# Altium schematic sheet soc.SchDoc: SoC
size A4; CheckedBy: None; DrawnBy: David, Andrea; Organization: ETSIT; DocumentNumber: 2; Revision: V1.0; SheetNumber: 2; SheetTotal: 7; SPICEModelCacheJYSJDKYB: <root> / <DocumentId>JYSJDKYB</DocumentId> / <CacheFrame Number="0"> / <Model Name="cap" Kind="MDL"> / <Text>*Default semiconductor capacitor / .MODEL CAP C()</Text> / </Model> / </CacheFrame> / </root>; TotalSheet: 7; VersionRevision: v1.0; Project: Hefesto; Company: ETSIT
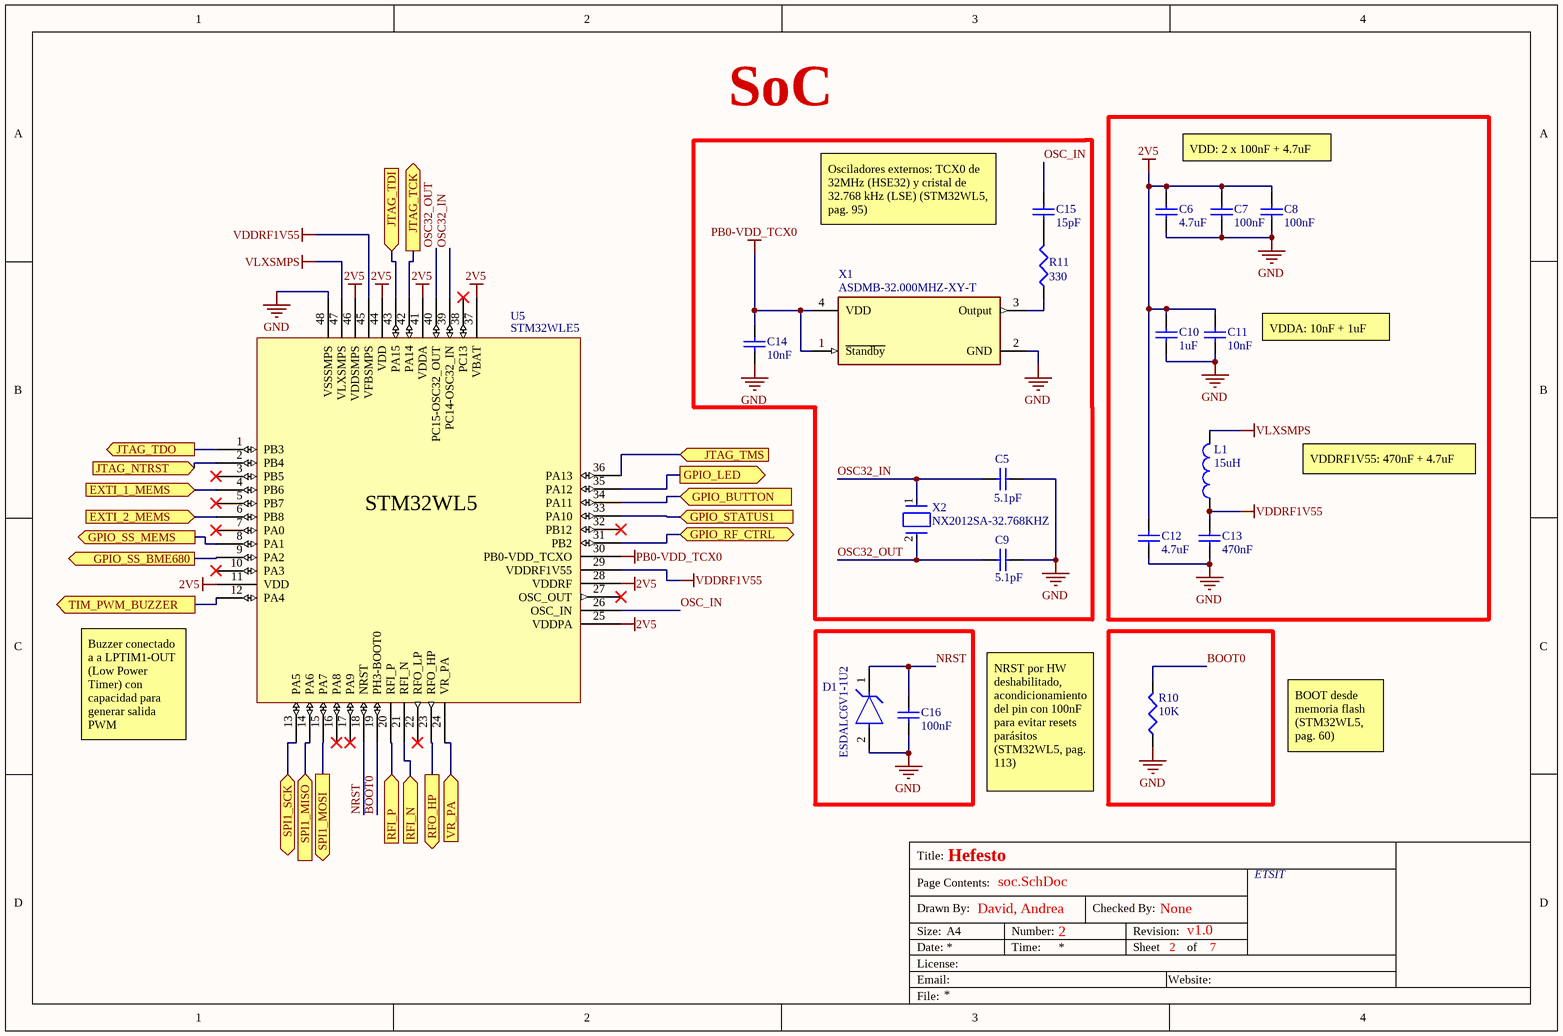
[diagram p0: soc.SchDoc]

## Parts
C5  value 5.1pF  [1608[0603]]  (hidden comment: Cap Semi)
C6  value 4.7uF  [1608[0603]]  (hidden comment: Cap Semi)
C7  value 100nF  [1608[0603]]  (hidden comment: Cap Semi)
C8  value 100nF  [1608[0603]]  (hidden comment: Cap Semi)
C9  value 5.1pF  [1608[0603]]  (hidden comment: Cap Semi)
C10  value 1uF  [1608[0603]]  (hidden comment: Cap Semi)
C11  value 10nF  [1608[0603]]  (hidden comment: Cap Semi)
C12  value 4.7uF  [1608[0603]]  (hidden comment: Cap Semi)
C13  value 470nF  [1608[0603]]  (hidden comment: Cap Semi)
C14  value 10nF  [1608[0603]]  (hidden comment: Cap Semi)
C15  value 15pF  [1608[0603]]  (hidden comment: Cap Semi)
C16  value 100nF  [1608[0603]]  (hidden comment: Cap Semi)
D1  ESDALC6V1-1U2  [FP-ST0201-MFG]
L1  value 15uH  [0603]  (hidden comment: Inductor)
R10  value 10K  [J1-0603]  (hidden comment: Res3)
R11  value 330  [J1-0603]  (hidden comment: Res3)
U5  STM32WLE5  [UFQFPN48]
X1  ASDMB-32.000MHZ-XY-T  [FP-ASDM-ASDMB-MFG]
X2  NX2012SA-32.768KHZ  [FP-NX2012SA-MFG]

## Ports
EXTI_1_MEMS (in, see main[2C]), EXTI_2_MEMS (in, see main[2C]), GPIO_BUTTON (in, see main[3B]), GPIO_LED (out, see main[3B]), GPIO_RF_CTRL (bidir, see main[3C]), GPIO_SS_BME680 (out, see main[2B]), GPIO_SS_MEMS (out, see main[2C]), GPIO_STATUS1 (in, see main[3B]), JTAG_NTRST (in, see main[2B], externalConnectors[3C]), JTAG_TCK (out, see main[2B], externalConnectors[3B]), JTAG_TDI (in, see main[2B], externalConnectors[3C]), JTAG_TDO (out, see main[2B], externalConnectors[3B]), JTAG_TMS (in, see main[2B], externalConnectors[3C]), RFI_N (in, see main[3C], rf[1C]), RFI_P (in, see main[3C], rf[1C]), RFO_HP (out, see main[2C], rf[1B]), SPI1_MISO (in, see main[2B]), SPI1_MOSI (out, see main[2B]), SPI1_SCK (bidir, see main[2B]), TIM_PWM_BUZZER (out, see main[3B]), VR_PA (in, see main[2C], rf[1B])

## Nets
2V5: C6.2 C7.2 C8.2 C10.2 C11.2 C12.2 U5.11(VDD) U5.25(VDDPA) U5.28(VDDRF) U5.37(VBAT) U5.41(VDDA) U5.44(VDD) U5.46(VDDSMPS)
GND: C5.1 C6.1 C7.1 C8.1 C9.1 C10.1 C11.1 C12.1 C13.1 C14.1 C16.1 D1.2(A) R10.1 U5.48(VSSSMPS) X1.2(GND)
PB0-VDD_TCX0: C14.2 U5.30(PB0-VDD_TCXO) X1.1(~{Standby}) X1.4(VDD)
VDDRF1V55: C13.2 L1.1 U5.29(VDDRF1V55) U5.45(VFBSMPS)
VLXSMPS: L1.2 U5.47(VLXSMPS)
BOOT0: R10.2 U5.19(PH3-BOOT0)
EXTI_1_MEMS: U5.4(PB6) ; port EXTI_1_MEMS
EXTI_2_MEMS: U5.6(PB8) ; port EXTI_2_MEMS
GPIO_BUTTON: U5.34(PA11) ; port GPIO_BUTTON
GPIO_LED: U5.35(PA12) ; port GPIO_LED
GPIO_RF_CTRL: U5.31(PB2) ; port GPIO_RF_CTRL
GPIO_SS_BME680: U5.9(PA2) ; port GPIO_SS_BME680
GPIO_SS_MEMS: U5.8(PA1) ; port GPIO_SS_MEMS
GPIO_STATUS1: U5.33(PA10) ; port GPIO_STATUS1
JTAG_NTRST: U5.2(PB4) ; port JTAG_NTRST
JTAG_TCK: U5.42(PA14) ; port JTAG_TCK
JTAG_TDI: U5.43(PA15) ; port JTAG_TDI
JTAG_TDO: U5.1(PB3) ; port JTAG_TDO
JTAG_TMS: U5.36(PA13) ; port JTAG_TMS
NRST: C16.2 D1.1(C) U5.18(NRST)
OSC32_IN: C5.2 U5.39(PC14-OSC32_IN) X2.1
OSC32_OUT: C9.2 U5.40(PC15-OSC32_OUT) X2.2
OSC_IN: C15.2 U5.26(OSC_IN)
RFI_N: U5.21(RFI_N) ; port RFI_N
RFI_P: U5.20(RFI_P) ; port RFI_P
RFO_HP: U5.23(RFO_HP) ; port RFO_HP
SPI1_MISO: U5.14(PA6) ; port SPI1_MISO
SPI1_MOSI: U5.15(PA7) ; port SPI1_MOSI
SPI1_SCK: U5.13(PA5) ; port SPI1_SCK
TIM_PWM_BUZZER: U5.12(PA4) ; port TIM_PWM_BUZZER
VR_PA: U5.24(VR_PA) ; port VR_PA
NetC15_1: C15.1 R11.2
NetR11_1: R11.1 X1.3(Output)

Not connected (* = marked no-connect by the designer): U5 3(PB5)* 5(PB7)* 7(PA0)* 10(PA3)* 16(PA8)* 17(PA9)* 22(RFO_LP)* 27(OSC_OUT)* 32(PB12)* 38(PC13)*

## Notes on the sheet
- VDD: 2 x 100nF + 4.7uF
- Osciladores externos: TCX0 de 32MHz (HSE32) y cristal de 32.768 kHz (LSE) (STM32WL5, pag. 95)
- (near C11) VDDA: 10nF + 1uF
- VDDRF1V55: 470nF + 4.7uF
- Buzzer conectado a a LPTIM1-OUT (Low Power Timer) con capacidad para generar salida PWM
- NRST por HW deshabilitado, acondicionamiento del pin con 100nF para evitar resets parásitos (STM32WL5, pag. 113)
- BOOT desde memoria flash (STM32WL5, pag. 60)
- Title:
- Drawn By:
- Page Contents:
- Checked By:
- Size:
- Date:
- File:
- License:
- Email:
- A4
- Number:
- Time:
- Revision:
- Sheet
- Website:
- of
- (in symbol STM32WLE5) STM32WL5

## Library data of the parts
C5-C16 = Cap Semi: Capacitor (Semiconductor SIM Model); Published: 8-Jun-2000; LatestRevisionDate: 29-May-2009; LatestRevisionNote: IPC-7351 Footprint Added.; PackageReference: C1206; Publisher: Altium Limited; PackageDescription: Chip Capacitor
D1 = CMP-12225-000007-1: TVS DIODE 3V ST0201; Manufacturer: STMicroelectronics; Number Of Channels: 1; Direction: Unidirectional; Max Junction Temp: +125°C; Breakdown Voltage: 6.1V; Capacitance: 12pF; Peak Pulse Current: 2A; Value: 12pF; Peak Pulse Power: 20W; Package: ST0201; Digikey Description: TVS DIODE 3V ST0201; Temperature Range High: +125°C; Octopart: https://octopart.com/esdalc6v1-1u2-stmicroelectronics-11912330; Category: Diode; Height: 0.33mm; RoHS: TRUE; ComponentLink2URL: https://www.st.com/content/ccc/resource/technical/document/datasheet/90/b1/aa/a3/9f/73/4d/1e/CD00212838.pdf/files/CD00212838.pdf/jcr:content/translations/en.CD00212838.pdf; Temperature Range Low: -40°C; Device Class L2: TVS Diodes; ComponentLink2Description: Datasheet; Manufacturer Part Number: ESDALC6V1-1U2; Device Class L1: Circuit Protection; Device Class L3: unset; Lead Free: Yes; Automotive: No; Mouser Description: TVS Diodes - Transient Voltage Suppressors Single-Line Low Cap ESD TVS 0201; Temperature: -40°C to +125°C
L1 = Inductor: Code_IEC: 1005; Published: 8-Jun-2000; LatestRevisionDate: 29-May-2009; LatestRevisionNote: IPC-7351 Footprint Added.; PackageReference: 0402-A; Publisher: Altium Limited; PackageDescription: Chip Inductor; Code_JEITA: 0402
R10 R11 = Res3: Resistor; Published: 8-Jun-2000; LatestRevisionDate: 29-May-2009; LatestRevisionNote: IPC-7351 Footprint Added.; PackageReference: J1-0603; Publisher: Altium Limited; PackageDescription: Chip Resistor
X1 = CMP-27762-009266-1: MEMS Oscillator 32MHz ±10ppm LVCMOS 1.8V~3.3V SMD 2.5x2mm; Operating Supply Voltage: 3.6V; Max Supply Current: 16mA; Load Capacitance: 15pF; Length: 0.098inch; Min Operating Temperature: -40°C; Case/Package: SMD/SMT; Number of Pins: 4; RoHS Compliant: Yes; Frequency Stability: 10ppm; Height: 0.035inch; Frequency: 32MHz; Packaging: Tape and Reel; Width: 0.079inch; Termination: SMD/SMT; Radiation Hardening: No; Max Operating Temperature: 105°C; Series: Pure Silicon™ ASDMB; Mount: Surface Mount
X2 = CMP-200220-000014-1: CRYSTAL 32.7680KHZ 6PF SMD